# Altium schematic sheet IO.SchDoc
size C
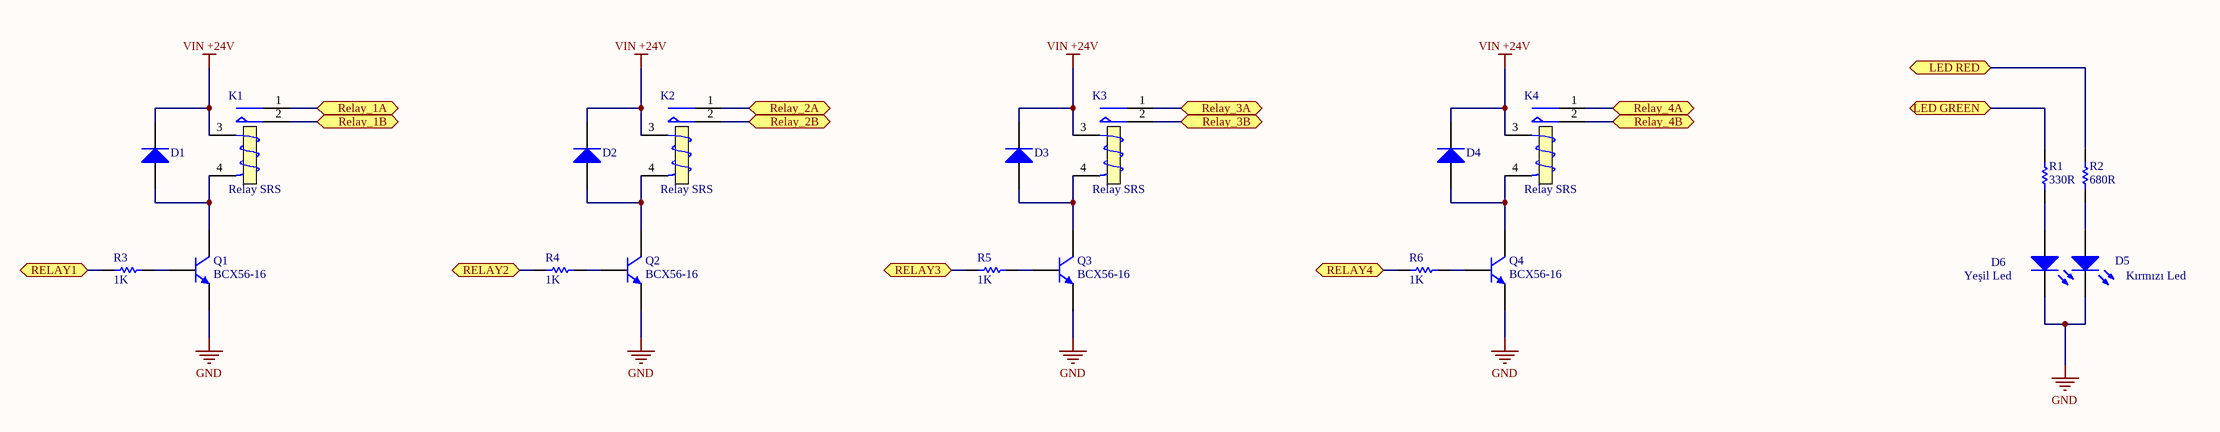
[diagram p0: IO.SchDoc]

## Parts
D1  Diode 1N4007  [DO214]  (value not drawn)
D2  Diode 1N4007  [DO214]  (value not drawn)
D3  Diode 1N4007  [DO214]  (value not drawn)
D4  Diode 1N4007  [DO214]  (value not drawn)
D5  Yeşil Led  [6-0805 - LED]
D6  Kırmızı Led  [6-0805 - LED]
K1  Relay SRS  [RELAY ALQ324]
K2  Relay SRS  [RELAY ALQ324]
K3  Relay SRS  [RELAY ALQ324]
K4  Relay SRS  [RELAY ALQ324]
Q1  BCX56-16  [SOT89M]
Q2  BCX56-16  [SOT89M]
Q3  BCX56-16  [SOT89M]
Q4  BCX56-16  [SOT89M]
R1  value 330R  [6-0805 - big]  (hidden comment: Res1)
R2  value 680R  [6-0805 - big]  (hidden comment: Res1)
R3  value 1K  [6-0805]  (hidden comment: Res1)
R4  value 1K  [6-0805]  (hidden comment: Res1)
R5  value 1K  [6-0805]  (hidden comment: Res1)
R6  value 1K  [6-0805]  (hidden comment: Res1)

## Ports
LED GREEN (bidir), LED RED (bidir), RELAY1 (bidir), RELAY2 (bidir), RELAY3 (bidir), RELAY4 (bidir), Relay_1A (bidir), Relay_1B (bidir), Relay_2A (bidir), Relay_2B (bidir), Relay_3A (bidir), Relay_3B (bidir), Relay_4A (bidir), Relay_4B (bidir)

## Nets
GND: D5.2(K) D6.2(K) Q1.3(E) Q2.3(E) Q3.3(E) Q4.3(E)
VIN +24V: D1.2(K) D2.2(K) D3.2(K) D4.2(K) K1.3(T1) K2.3(T1) K3.3(T1) K4.3(T1)
LED GREEN: R1.2 ; port LED GREEN
LED RED: R2.2 ; port LED RED
RELAY1: R3.1 ; port RELAY1
RELAY2: R4.1 ; port RELAY2
RELAY3: R5.1 ; port RELAY3
RELAY4: R6.1 ; port RELAY4
Relay_1A: K1.1(COM) ; port Relay_1A
Relay_1B: K1.2(NC) ; port Relay_1B
Relay_2A: K2.1(COM) ; port Relay_2A
Relay_2B: K2.2(NC) ; port Relay_2B
Relay_3A: K3.1(COM) ; port Relay_3A
Relay_3B: K3.2(NC) ; port Relay_3B
Relay_4A: K4.1(COM) ; port Relay_4A
Relay_4B: K4.2(NC) ; port Relay_4B
NetD1_1: D1.1(A) K1.4(T2) Q1.2(C)
NetD2_1: D2.1(A) K2.4(T2) Q2.2(C)
NetD3_1: D3.1(A) K3.4(T2) Q3.2(C)
NetD4_1: D4.1(A) K4.4(T2) Q4.2(C)
NetD5_1: D5.1(A) R2.1
NetD6_1: D6.1(A) R1.1
NetQ1_1: Q1.1(B) R3.2
NetQ2_1: Q2.1(B) R4.2
NetQ3_1: Q3.1(B) R5.2
NetQ4_1: Q4.1(B) R6.2

## Library data of the parts
D1-D4 = Diode 1N4007: 1 Amp General Purpose Rectifier; Published: 8-Jun-2000; LatestRevisionDate: 17-Jul-2002; LatestRevisionNote: Re-released for DXP Platform.; DatasheetDocument: 1998; PackageDocument: Aug-1999; PackageReference: DO-41; Publisher: Altium Limited; Code_JEDEC: DO-204-AL; ComponentLink1Description: Manufacturer Link; ComponentLink1URL: http://www.fairchildsemi.com/; ComponentLink2Description: Datasheet; ComponentLink2URL: http://www.fairchildsemi.com/ds/1N%2F1N4001.pdf
D5 D6 = LED: Typical INFRARED GaAs LED; Published: 8-Jun-2000; LatestRevisionDate: 08-Jul-2005; LatestRevisionNote: Mech Layer 1 removed.; PackageReference: LED-0; Publisher: Altium Limited
K1-K4 = Relay ALQ324: Published: 8-Jun-2000; Revision: July-2002: Re-released for DXP Platform.; Publisher: Altium Limited
Q1-Q4 = BCX56-16: NPN General-purpose Transistor; Published: 17-Sep-2003; LatestRevisionDate: 12-Dec-2006; LatestRevisionNote: IPC-7351 Footprint Added.; DatasheetVersion: Jun-1999; PackageVersion: May-1999; PackageReference: SOT23; Publisher: Altium Limited; PackageDescription: 3-Pin SOT-23 Package 0.95 mm Pitch, 2.3 mm Lead Span; ComponentLink1Description: Manufacturer Link; ComponentLink1URL: http://www.semiconductors.philips.com/; ComponentLink2Description: Datasheet; ComponentLink2URL: http://www.semiconductors.philips.com/acrobat/datasheets/BC817_BC817W_BC337_5.pdf
R1-R6 = Res1: Resistor; Published: 8-Jun-2000; LatestRevisionDate: 17-Jul-2002; LatestRevisionNote: Re-released for DXP Platform.; PackageReference: AXIAL-0.3; Publisher: Altium Limited